# EAGLE design IO_ports (EAGLE 9.6.2)
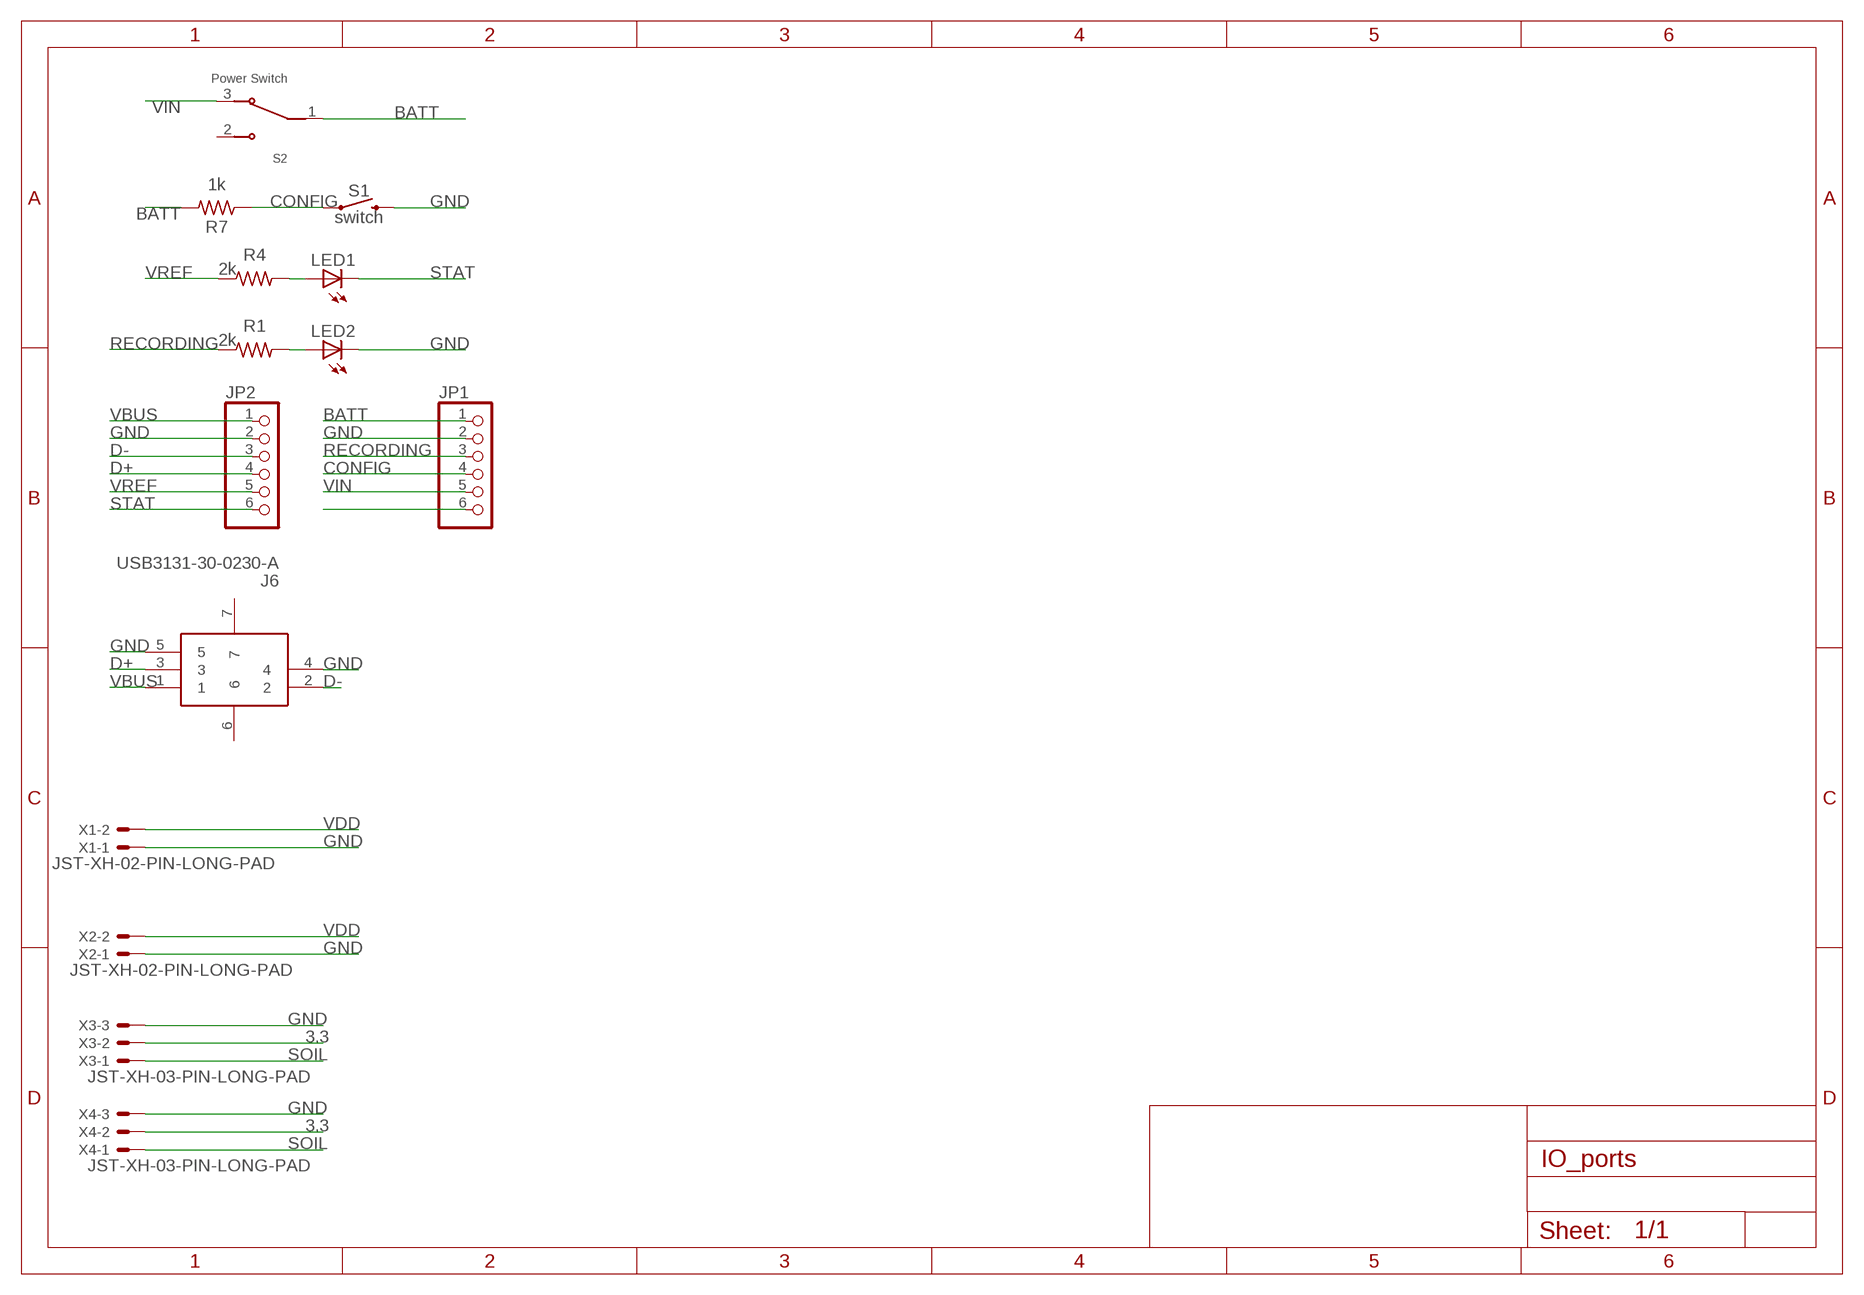
[diagram p0: schematic, sheet 1]

## Parts
J6  USB3131-30-0230-A  [USB3131300230A]
JP1  PINHD-1X6JSTXH  [JST-XH-06-PACKAGE-ROUND-PAD]
JP2  PINHD-1X6JSTXH  [JST-XH-06-PACKAGE-ROUND-PAD]
LED1  LEDCHIP-LED0805  [CHIP-LED0805]
LED2  LEDCHIP-LED0805  [CHIP-LED0805]
R1  2k  R-US_M0805  [M0805]
R4  2k  R-US_M0805  [M0805]
R7  1k  R-US_CHIP-0805(2012-METRIC)  [RESC2012X65]
S1  switch  MOMENTARY-SWITCH-SPST-PTH-6.0MM  [TACTILE_SWITCH_PTH_6.0MM]
S2  Power Switch  MSS-102545-28A-D  [SW_MSS-102545-28A-D]
X1  JST-XH-02-PIN-LONG-PAD  [JST-XH-02-PACKAGE-LONG-PAD]
X2  JST-XH-02-PIN-LONG-PAD  [JST-XH-02-PACKAGE-LONG-PAD]
X3  JST-XH-03-PIN-LONG-PAD  [JST-XH-03-PACKAGE-LONG-PAD]
X4  JST-XH-03-PIN-LONG-PAD  [JST-XH-03-PACKAGE-LONG-PAD]

## Nets
3.3: X3.2 X4.2
BATT: JP1.1 R7.2 S2.1
CONFIG: JP1.4 R7.1 S1.1
D+: J6.3 JP2.4
D-: J6.2 JP2.3
GND: J6.4 J6.5 JP1.2 JP2.2 LED2.C S1.3 X1.1 X2.1 X3.3 X4.3
N$1: LED2.A R1.2
N$4: LED1.A R4.2
N$10: JP1.6
RECORDING: JP1.3 R1.1
SOIL: X3.1 X4.1
STAT: JP2.6 LED1.C
VBUS: J6.1 JP2.1
VDD: X1.2 X2.2
VIN: JP1.5 S2.3
VREF: JP2.5 R4.1
Unconnected: J6.6 J6.7 S2.2

## Library data of the parts
J6 = SamacSys_Parts:USB3131-30-0230-A: GCT (GLOBAL CONNECTOR TECHNOLOGY) - USB3131-30-0230-A - MICRO USB, 2.0 TYPE B, RECEPTACLE, THT Source: Datasheet <https://gct.co/files/drawings/usb3131.pdf>; DESCRIPTION: GCT (GLOBAL CONNECTOR TECHNOLOGY) - USB3131-30-0230-A - MICRO USB, 2.0 TYPE B, RECEPTACLE, THT; HEIGHT: 5.6mm; MANUFACTURER_NAME: GCT (GLOBAL CONNECTOR TECHNOLOGY); MANUFACTURER_PART_NUMBER: USB3131-30-0230-A; MOUSER_PART_NUMBER: 640-USB3131300230A; MOUSER_PRICE-STOCK: https://www.mouser.co.uk/ProductDetail/GCT/USB3131-30-0230-A?qs=KUoIvG%2F9IlYmRfH6E2AKbw%3D%3D
JP1 JP2 = pinhead:PINHD-1X6: PIN HEADER
LED1 LED2 = adafruit:LED: LED OSRAM: - CHIPLED LG R971, LG N971, LY N971, LG Q971, LY Q971, LO R971, LY R971 LH N974, LH R974 LS Q976, LO Q976, LY Q976 LO Q996 - Hyper CHIPLED LW Q18S LB Q993, LB Q99A, LB R99A - SideLED LS A670, LO A670, LY A670, LG A670, LP A670 LB A673, LV A673, LT A673, LW A673 LH A674 LY A675 LS A676, LA A676, LO A676, LY A676, LW A676 LS A679, LY A679, LG A679 - Hyper Micro SIDELED® LS Y876, LA Y876, LO Y876, LY Y876 LT Y87S - SmartLED LW L88C, LW L88S LB L89C, LB L89S, LG L890 LS L89K, LO L89K, LY L89K LS L896, LA L896, LO L896, LY L896 - TOPLED LS T670, LO T670, LY T670, LG T670, LP T670 LSG T670, LSP T670, LSY T670, LOP T670, LYG T670 LG T671, LOG T671, LSG T671 LB T673, LV T673, LT T673, LW T673 LH T674 LS T676, LA T676, LO T676, LY T676, LB T676, LH T676, LSB T676, LW T676 LB T67C, LV T67C, LT T67C, LS T67K, LO T67K, LY T67K, LW E67C LS E67B, LA E67B, LO E67B, LY E67B, LB E67C, LV E67C, LT E67C LW T67C LS T679, LY T679, LG T679 LS T770, LO T770, LY T770, LG T770, LP T770 LB T773, LV T773, LT T773, LW T773 LH T774 LS E675, LA E675, LY E675, LS T675 LS T776, LA T776, LO T776, LY T776, LB T776 LHGB T686 LT T68C, LB T68C - Hyper Mini TOPLED® LB M676 - Mini TOPLED Santana® LG M470 LS M47K, LO M47K, LY M47K Source: http://www.osram.convergy.de/
R1 R4 = adafruit:R-US_: RESISTOR, American symbol
R7 = Resistor:R-US: Resistor Fixed - ANSI; CATEGORY: Resistor; SUB-CATEGORY: Fixed
S1 = SparkFun-Switches:MOMENTARY-SWITCH-SPST: Momentary Switch (Pushbutton) - SPST Normally-open (NO) SPST momentary switches (buttons, pushbuttons). Variants PTH-12MM - 12mm square, through-hole Momentary Pushbutton Switch - 12mm Square <https://www.sparkfun.com/products/9190> (COM-09190) PTH-6.0MM, PTH-6.0MM-KIT - 6.0mm square, through-hole Mini Pushbutton Switch <https://www.sparkfun.com/products/97> (COM-00097) KIT package intended for soldering kit's - only one side of pads' copper is exposed. PTH-RIGHT-ANGLE-KIT - Right-angle, through-hole Right Angle Tactile Button <https://www.sparkfun.com/products/10791> - Used on SparkFun BigTime Watch Kit <https://www.sparkfun.com/products/11734> SMD-12MM - 12mm square, surface-mount Tactile Button - SMD (12mm) <https://www.sparkfun.com/products/12993> (COM-12993) Used on SparkFun PicoBoard <https://www.sparkfun.com/products/11888> SMD-4.5MM - 4.5mm Square Trackball Switch Used on SparkFun Blackberry Trackballer Breakout <https://www.sparkfun.com/products/13169> SMD-4.6MMX2.8MM - 4.60mm x 2.80mm, surface mount Used on SparkFun SAMD21 Mini Breakout <https://www.sparkfun.com/products/13664> SMD-5.2MM, SMD-5.2-REDUNDANT - 5.2mm square, surface-mount Mini Pushbutton Switch - SMD <https://www.sparkfun.com/products/8720> (COM-08720) Used on Arduino Pro Mini <https://www.sparkfun.com/products/11114> REDUNDANT package connects both switch circuits together SMD-6.0X3.5MM - 6.0 x 3.5mm, surface mount Momentary Reset Switch SMD <https://www.sparkfun.com/products/8229> (COM-08229) SMD-6.2MM-TALL - 6.2mm square, surface mount Tactile Button - SMD (6mm) <https://www.sparkfun.com/products/12992> Used on SparkFun Digital Sandbox <https://www.sparkfun.com/products/12651> SMD-RIGHT-ANGLE - Right-angle, surface mount Used on SparkFun Block for Intel® Edison - Arduino <https://www.sparkfun.com/products/13036>; PROD_ID: SWCH-08441; SF_SKU: COM-00097
S2 = MSS-102545-28A-D:MSS-102545-28A-D: Check availability <https://pricing.snapeda.com/parts/MSS-102545-28A-D/CUI%20Devices/view-part?ref=eda>; AVAILABILITY: In Stock; CUI_PURCHASE_URL: https://www.cuidevices.com/product/switches/slide-switches/mss-102545-28a-d?utm_source=snapeda.com&utm_medium=referral&utm_campaign=snapedaBOM; DESCRIPTION: 10 x 2.5 x 7.8 mm, 2.8 mm Raised Slide Actuator, Through Hole, Miniature Slide Switch; MF: CUI Devices; MP: MSS-102545-28A-D; PACKAGE: None; PRICE: None; PURCHASE-URL: https://pricing.snapeda.com/search/part/MSS-102545-28A-D/?ref=eda
X1 X2 = Rembrandt Electronics - JST XH Connectors v1-0:JST-XH-02-PIN: JST XH Connector 2 Pin Wire to board connector. Pitch: 2,54 mm, (0.100") Number of pins: 2 Created by Rembrandt Electronics www.rembrandtelectronics.com
X3 X4 = Rembrandt Electronics - JST XH Connectors v1-0:JST-XH-03-PIN: JST XH Connector 2 Pin Wire to board connector. Pitch: 2,54 mm, (0.100") Number of pins: 3 Created by Rembrandt Electronics www.rembrandtelectronics.com

## Board
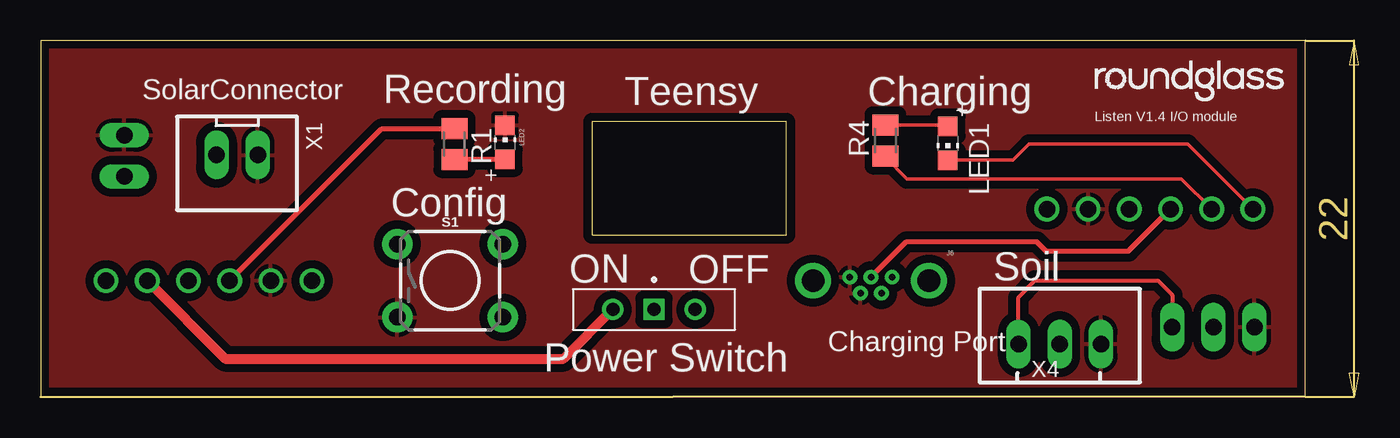
[diagram p1: board, top side]
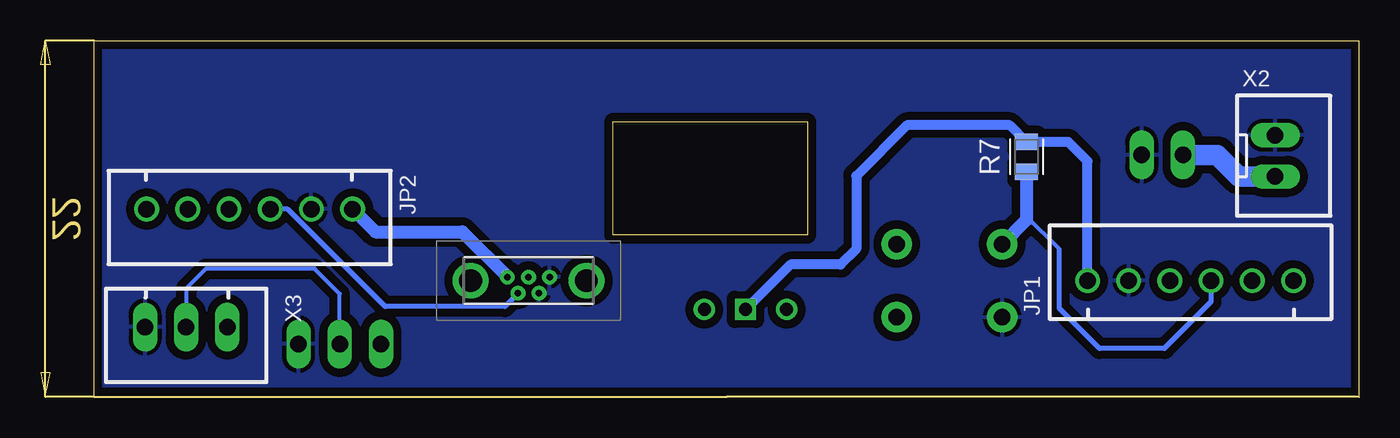
[diagram p2: board, bottom side, seen from below]

Size 78 x 22 mm. Coordinates in mm from the lower left corner, seen from the top.
Outline: 0,0 78,0 78,22 0,22 0,0
Outline: 34,17 34,10 46,10 46,17 34,17
Copper layers (1*16): Top 0.035mm / dielectric 1.5mm / Bottom 0.035mm
Design rules "jotElectronics": minimum track width 6mil, minimum drill 0.5mm, track to track 0.5mm, track to pad 0.25mm, pad to pad 6mil, via to via 0.25mm, smd to smd 0.25mm, copper to edge 0.5mm, drill to drill 0.5mm, minimum pad ring 10mil, minimum via ring 10mil, stop-mask expansion 4mil, vias tented up to drill 0mil, thermal gap 10mil

### Footprints (pad centres in the part's own frame; a part is rotated, then mirrored left to right if it is on the bottom)
USB3131300230A = drill 0.4 pad 0.8: 1 0,0; 2 0.65,-1; 3 1.3,0; 4 1.95,-1; 5 2.6,0 | drill 1.395 pad 2.2: 6 -2.275,-0.22; 7 4.875,-0.22
JST-XH-06-PACKAGE-ROUND-PAD = drill 1.016: 1 -6.35,0; 2 -3.81,0; 3 -1.27,0; 4 1.27,0; 5 3.81,0; 6 6.35,0
CHIP-LED0805 = smd 1.2 x 1.2: A 0,-1.05; C 0,1.05
M0805 = smd 1.3 x 1.6: 1 -0.95,0; 2 0.95,0
RESC2012X65 = smd 1.031 x 1.42: 1 -0.919,0; 2 0.919,0
TACTILE_SWITCH_PTH_6.0MM = drill 1.016 pad 1.88: 1 -3.251,2.261; 2 3.251,2.261; 3 -3.251,-2.261; 4 3.251,-2.261
SW_MSS-102545-28A-D = drill 0.8 square: 1 0,0 | drill 0.8: 2 -2.54,0; 3 2.54,0
JST-XH-02-PACKAGE-LONG-PAD = drill 1.016 long: 1 -1.27,0; 2 1.27,0
JST-XH-03-PACKAGE-LONG-PAD = drill 1.016 long: 1 -2.54,0; 2 0,0; 3 2.54,0

### Placement (x,y rotation side)
J6  52.51,7.4 0 bottom
JP1  10.39,7.18 0 bottom
JP2  68.41,11.6 180 bottom
LED1  55.95,15.66 180 top
LED2  28.64,15.72 0 top
R1  25.52,15.61 270 top
R4  52.1,15.83 90 top
R7  20.5,14.82 90 bottom
S1  25.25,7.18 0 top
S2  37.83,5.4 180 top
X1  12.12,14.94 180 top
X2  5.16,14.89 270 bottom
X3  72.32,4.32 180 bottom
X4  62.85,3.27 0 top

### Tracks (layer width: path | path; a pad name or v marks a point on that pad's centre or on a via)
3.3
  Bottom 0.254: X4.2 62.85,6.37 64.39,7.91 71.11,7.91 72.32,6.7 X3.2
BATT
  Bottom 0.61: JP1.1 16.74,14.56 17.92,15.74 R7.2 21.53,16.77 27.87,16.77 31,13.64 31,9.15 31.97,8.18 35.05,8.18 S2.1 37.75,5.4
CONFIG
  Bottom 0.254: 18.48,9.12 20.5,11.15
  Bottom 0.305: JP1.4 9.12,5.88 12,3 16,3 18.48,5.47 18.48,9.12
  Bottom 0.61: 20.5,11.15 20.5,12
  Bottom 0.813: R7.1 20.5,12 20.5,10.94 S1.1
D+
  Top 0.305: J6.3 53.4,9.59 61.41,9.59 62,9 67.08,9 JP2.4
D-
  Bottom 0.305: J6.2 52.67,5.59 60.05,5.59 66.06,11.6 JP2.3
GND
  pour Bottom: 0,0 78,0 78,22 0,22
  pour Top: 0,0 78,0 78,22 0,22
N$1
  Top 0.305: R1.2 LED2.A
N$4
  Top 0.203: R4.2 55.88,16.78 LED1.A
RECORDING
  Top 0.305: JP1.3 21.04,16.56 R1.1
SOIL
  Top 0.254: 69.78,4.37 X3.1 69.78,6.29 68.89,7.18 61.33,7.18 60.31,6.16 X4.1
STAT
  Top 0.203: LED1.C 59.95,14.61 60.95,15.61 70.75,15.61 JP2.6
VBUS
  Bottom 0.813: J6.1 55.3,10.19 60.65,10.19 JP2.1
VDD
  Bottom 1.27: X2.2 7.4,13.62 8.72,14.94 X1.2
VIN
  Top 0.61: JP1.5 11.4,2.36 32.24,2.36 S2.3
VREF
  Top 0.203: R4.1 52.1,14.8 53.44,13.46 70.36,13.46 JP2.5

### Text on the board
tPlace: Recording | Charging | Config | ON | OFF | Soil | Charging Port | Power Switch
tNames: SolarConnector | Teensy | Listen V1.4 I/O module